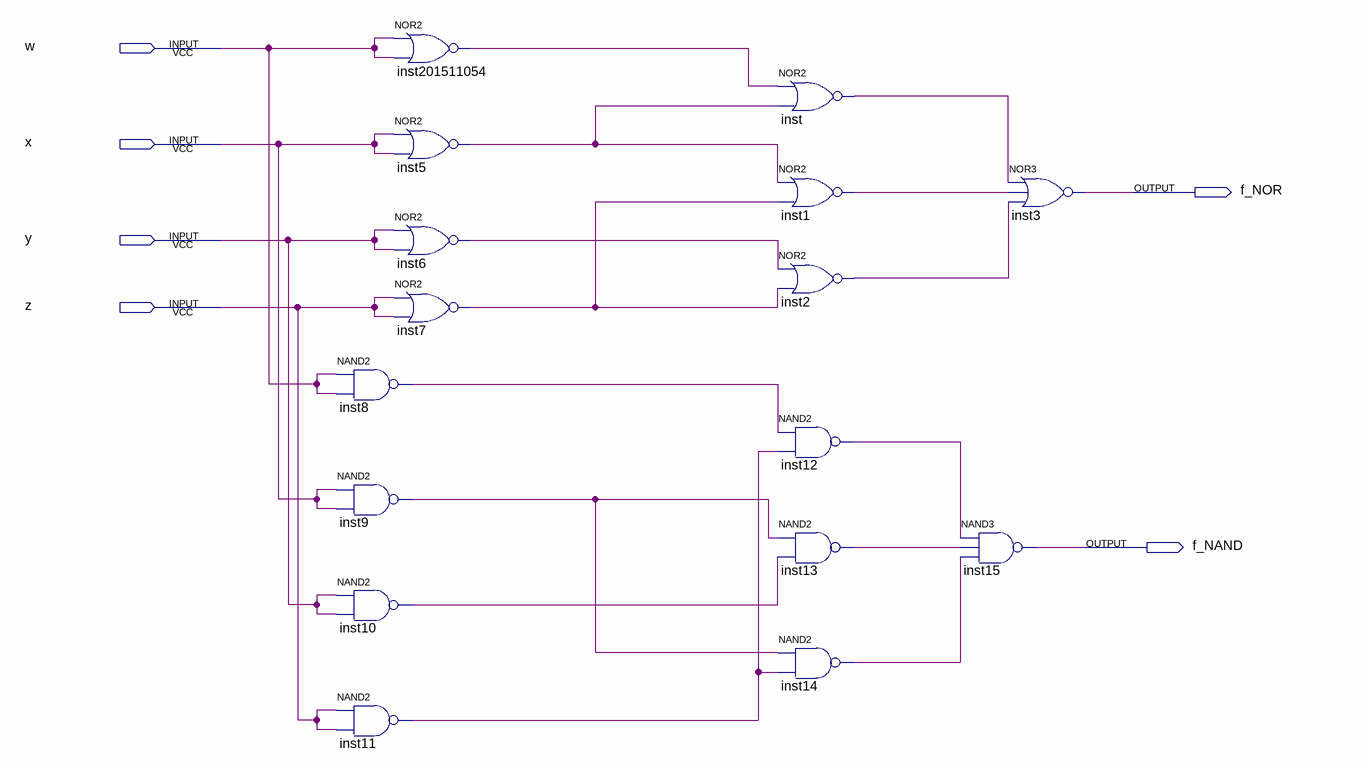
[diagram p0: schematic sheet]
// Quartus schematic lab02_1.bdf as structural Verilog: 16 symbols, 6 pins
module lab02_1 (
  input  w,
  input  x,
  input  y,
  input  z,
  output f_NOR,
  output f_NAND
);

  wire inst1_out, inst2_out, inst5_out, inst6_out, inst7_out, inst8_out, inst9_out, inst10_out, inst11_out,
       inst12_out, inst13_out, inst14_out, inst201511054_out, inst_out;

  nand inst8 (inst8_out, w, w);
  nand inst9 (inst9_out, x, x);
  nand inst10 (inst10_out, y, y);
  nand inst11 (inst11_out, z, z);
  nor inst201511054 (inst201511054_out, w, w);
  nor inst5 (inst5_out, x, x);
  nor inst6 (inst6_out, y, y);
  nor inst7 (inst7_out, z, z);
  nor inst (inst_out, inst201511054_out, inst5_out);
  nor inst1 (inst1_out, inst5_out, inst7_out);
  nor inst2 (inst2_out, inst6_out, inst7_out);
  nand inst12 (inst12_out, inst8_out, inst11_out);
  nand inst13 (inst13_out, inst9_out, inst10_out);
  nand inst14 (inst14_out, inst9_out, inst11_out);
  nand inst15 (f_NAND, inst12_out, inst13_out, inst14_out);
  nor inst3 (f_NOR, inst_out, inst1_out, inst2_out);
endmodule
